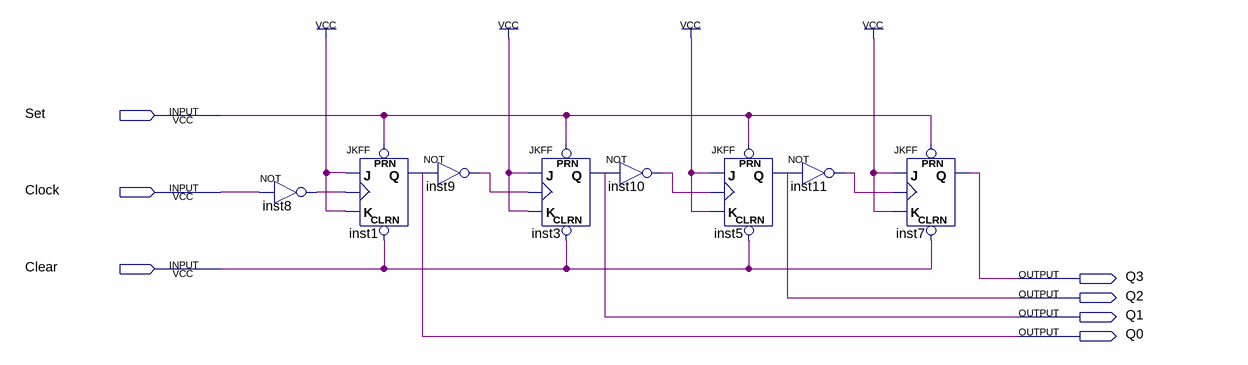
[diagram p0: schematic sheet]
// Quartus schematic counter1.bdf as structural Verilog: 8 symbols, 7 pins
module counter1 (
  input  Set,
  input  Clock,
  input  Clear,
  output Q3,
  output Q2,
  output Q1,
  output Q0
);

  wire inst8_out, inst9_out, inst10_out, inst11_out;

  not inst8 (inst8_out, Clock);
  JKFF inst1 (.PRN(Set), .CLRN(Clear), .K(1'b1), .J(1'b1), .CLK(inst8_out), .Q(Q0));
  not inst9 (inst9_out, Q0);
  JKFF inst3 (.PRN(Set), .CLRN(Clear), .K(1'b1), .J(1'b1), .CLK(inst9_out), .Q(Q1));
  not inst10 (inst10_out, Q1);
  JKFF inst5 (.PRN(Set), .CLRN(Clear), .K(1'b1), .J(1'b1), .CLK(inst10_out), .Q(Q2));
  not inst11 (inst11_out, Q2);
  JKFF inst7 (.PRN(Set), .CLRN(Clear), .K(1'b1), .J(1'b1), .CLK(inst11_out), .Q(Q3));
endmodule
